# Altium schematic sheet MCU HC32F460KETA.SchDoc
size A4; SheetNumber: 12; SheetTotal: 12
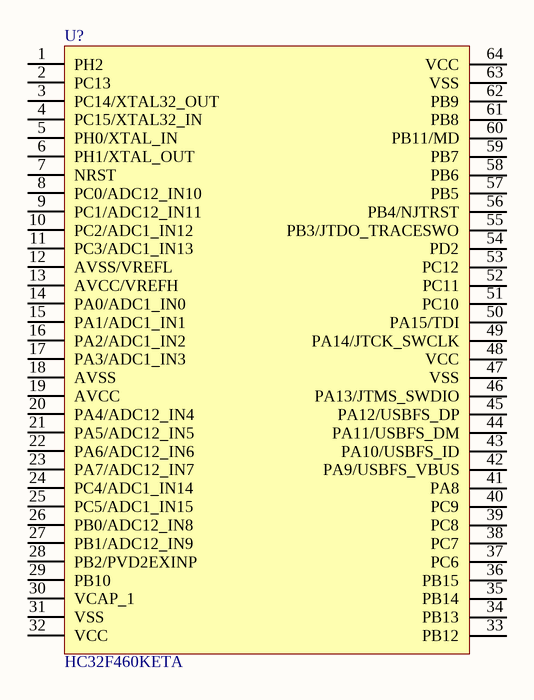
[diagram p0: MCU HC32F460KETA.SchDoc]

## Parts
U?  HC32F460KETA  [TSQFP50P1200X1200X160-64N]

## Nets

Not connected (* = marked no-connect by the designer): U? 1(PH2) 2(PC13) 3(PC14/XTAL32_OUT) 4(PC15/XTAL32_IN) 5(PH0/XTAL_IN) 6(PH1/XTAL_OUT) 7(NRST) 8(PC0/ADC12_IN10) 9(PC1/ADC12_IN11) 10(PC2/ADC1_IN12) 11(PC3/ADC1_IN13) 12(AVSS/VREFL) 13(AVCC/VREFH) 14(PA0/ADC1_IN0) 15(PA1/ADC1_IN1) 16(PA2/ADC1_IN2) 17(PA3/ADC1_IN3) 18(AVSS) 19(AVCC) 20(PA4/ADC12_IN4) 21(PA5/ADC12_IN5) 22(PA6/ADC12_IN6) 23(PA7/ADC12_IN7) 24(PC4/ADC1_IN14) 25(PC5/ADC1_IN15) 26(PB0/ADC12_IN8) 27(PB1/ADC12_IN9) 28(PB2/PVD2EXINP) 29(PB10) 30(VCAP_1) 31(VSS) 32(VCC) 33(PB12) 34(PB13) 35(PB14) 36(PB15) 37(PC6) 38(PC7) 39(PC8) 40(PC9) 41(PA8) 42(PA9/USBFS_VBUS) 43(PA10/USBFS_ID) 44(PA11/USBFS_DM) 45(PA12/USBFS_DP) 46(PA13/JTMS_SWDIO) 47(VSS) 48(VCC) 49(PA14/JTCK_SWCLK) 50(PA15/TDI) 51(PC10) 52(PC11) 53(PC12) 54(PD2) 55(PB3/JTDO_TRACESWO) 56(PB4/NJTRST) 57(PB5) 58(PB6) 59(PB7) 60(PB11/MD) 61(PB8) 62(PB9) 63(VSS) 64(VCC)

## Library data of the parts
U? = HC32F460KETA: Manufacturer: XHSC; Part Number: HC32F460KETA; ComponentLink1URL: https://datasheet.lcsc.com/lcsc/2206131716_XHSC-HC32F460KETA-LQFP64_C784659.pdf; ComponentLink1Description: Datasheet; Package: LQFP-64; Part Status: Active